# Altium schematic sheet ActuatorMKII_Microcontroller.SchDoc: ActuatorMKII_Microcontroller
size B; Date: MM/DD/YYYY; Author: Dylan Trainor; Organization: ORGANIZATION; Address1: ADDRESS 1; Address2: ADDRESS 2; Address3: ADDRESS 3; Address4: ADDRESS 4; Revision: -; SheetNumber: 4; SheetTotal: 6; ENG_APP_DATE: --/--/--; DSN_APP_DATE: --/--/--; CHK_APP_DATE: --/--/--
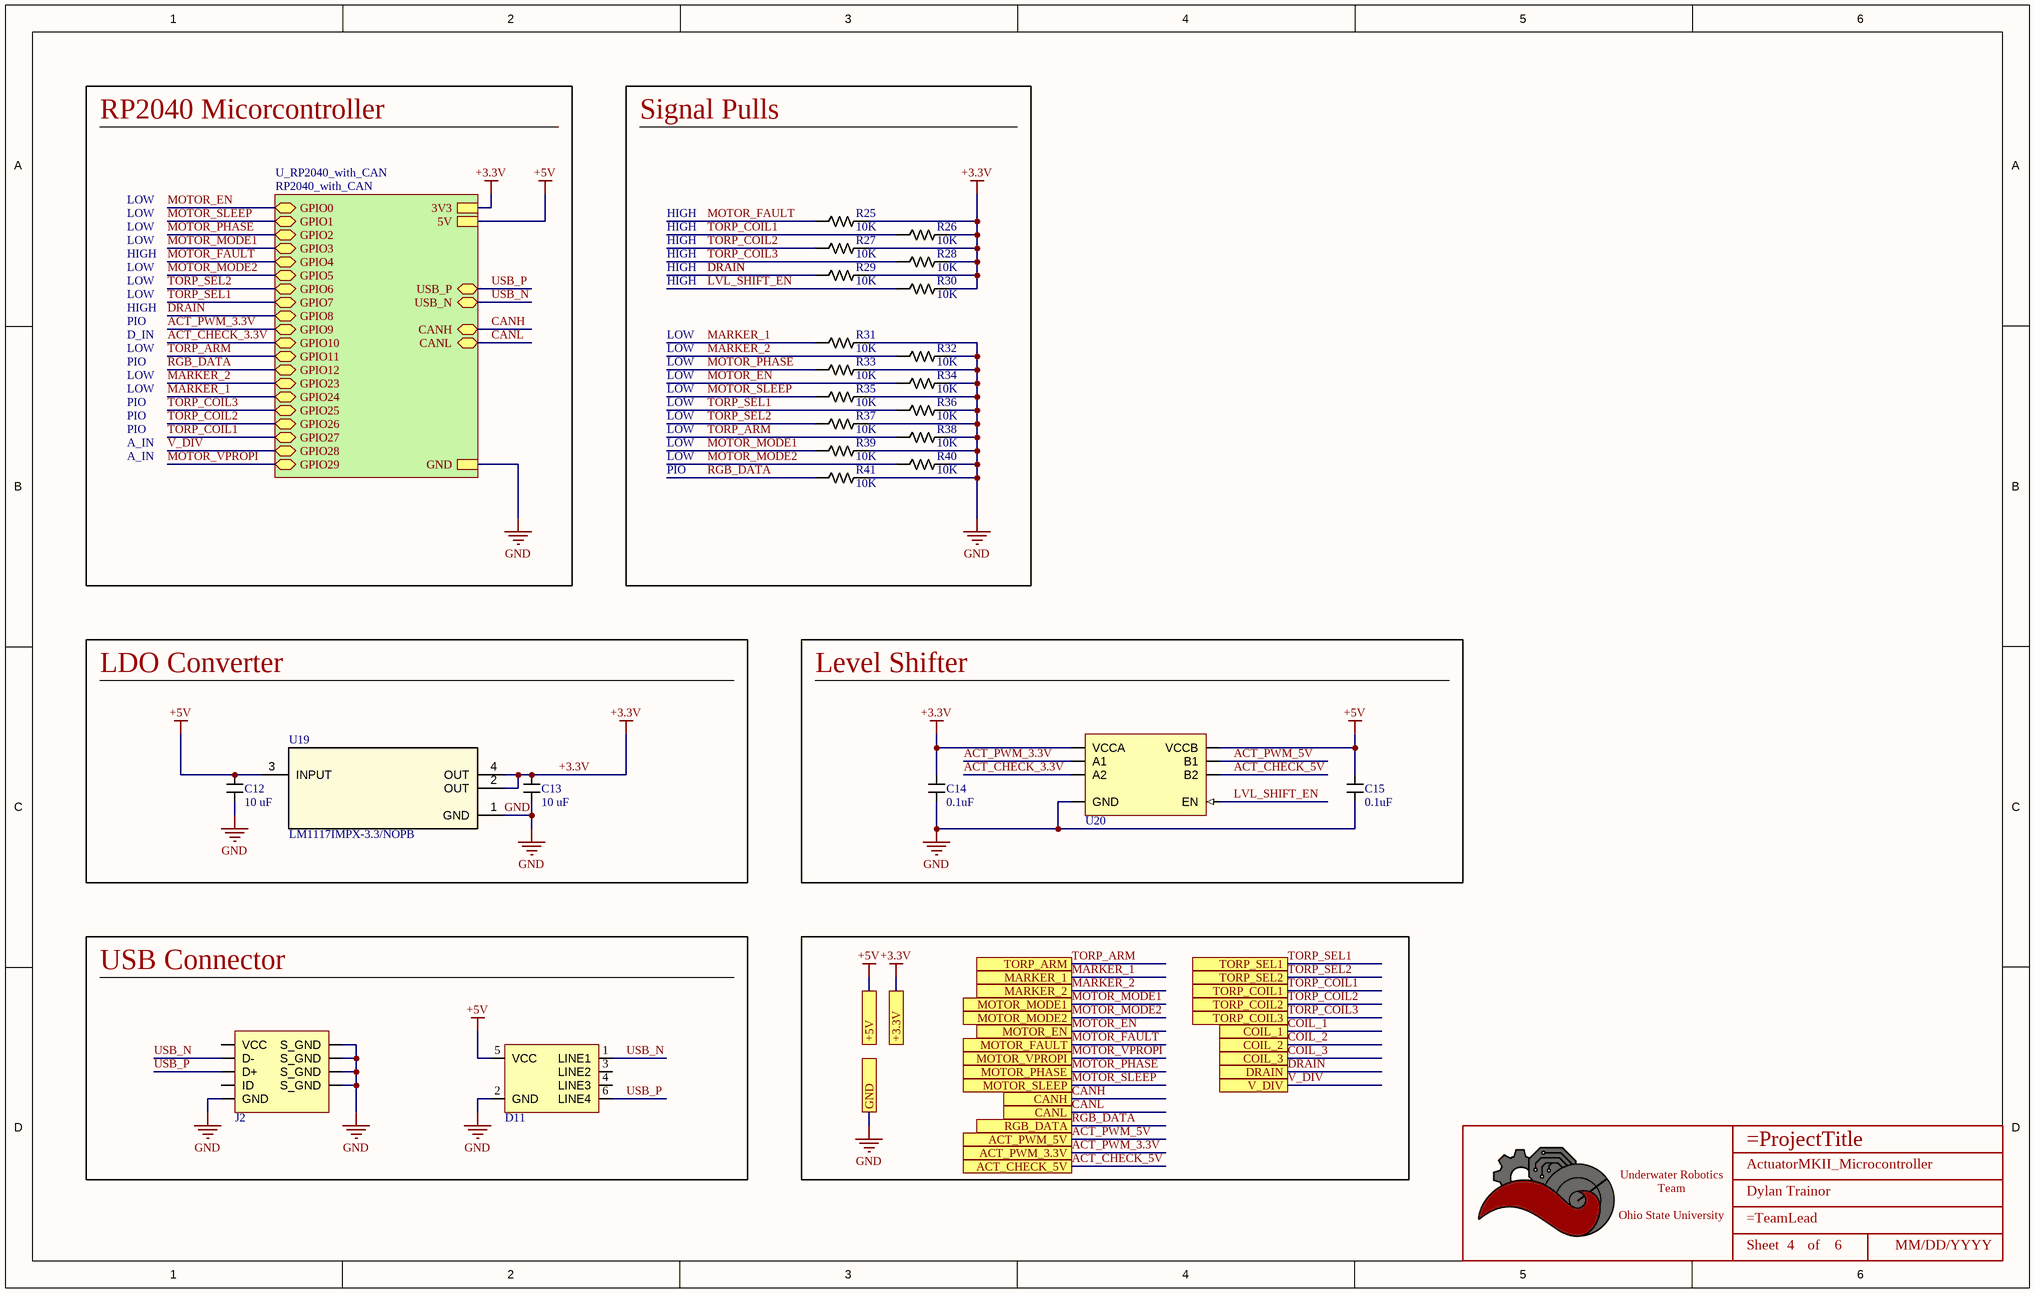
[diagram p0: ActuatorMKII_Microcontroller.SchDoc]

## Parts
*  Title_Block  [LOGO]  (value not drawn)  (graphical)
C12  Value (uF): 10 uF  [CAPACITOR_0603]  (hidden comment: 10uF Ceramic 6.3V)
C13  Value (uF): 10 uF  [CAPACITOR_0603]  (hidden comment: 10uF Ceramic 6.3V)
C14  value 0.1uF  [CAPACITOR_0603]  (hidden comment: 100nF Ceramic 6.3V)
C15  value 0.1uF  [CAPACITOR_0603]  (hidden comment: 100nF Ceramic 6.3V)
D11  TVS DIODE 5VWM 25VC SOT23-6  [SOT 23-6L]  (value not drawn)
J2  USB_MICRO R/A  [CONN_MINIUSB]  (value not drawn)
R25  Value  (Ohms): 10K  [RESISTOR_0603]  (hidden comment: 10k Ohm 5% 1/10W)
R26  Value  (Ohms): 10K  [RESISTOR_0603]  (hidden comment: 10k Ohm 5% 1/10W)
R27  Value  (Ohms): 10K  [RESISTOR_0603]  (hidden comment: 10k Ohm 5% 1/10W)
R28  Value  (Ohms): 10K  [RESISTOR_0603]  (hidden comment: 10k Ohm 5% 1/10W)
R29  Value  (Ohms): 10K  [RESISTOR_0603]  (hidden comment: 10k Ohm 5% 1/10W)
R30  Value  (Ohms): 10K  [RESISTOR_0603]  (hidden comment: 10k Ohm 5% 1/10W)
R31  Value  (Ohms): 10K  [RESISTOR_0603]  (hidden comment: 10k Ohm 5% 1/10W)
R32  Value  (Ohms): 10K  [RESISTOR_0603]  (hidden comment: 10k Ohm 5% 1/10W)
R33  Value  (Ohms): 10K  [RESISTOR_0603]  (hidden comment: 10k Ohm 5% 1/10W)
R34  Value  (Ohms): 10K  [RESISTOR_0603]  (hidden comment: 10k Ohm 5% 1/10W)
R35  Value  (Ohms): 10K  [RESISTOR_0603]  (hidden comment: 10k Ohm 5% 1/10W)
R36  Value  (Ohms): 10K  [RESISTOR_0603]  (hidden comment: 10k Ohm 5% 1/10W)
R37  Value  (Ohms): 10K  [RESISTOR_0603]  (hidden comment: 10k Ohm 5% 1/10W)
R38  Value  (Ohms): 10K  [RESISTOR_0603]  (hidden comment: 10k Ohm 5% 1/10W)
R39  Value  (Ohms): 10K  [RESISTOR_0603]  (hidden comment: 10k Ohm 5% 1/10W)
R40  Value  (Ohms): 10K  [RESISTOR_0603]  (hidden comment: 10k Ohm 5% 1/10W)
R41  Value  (Ohms): 10K  [RESISTOR_0603]  (hidden comment: 10k Ohm 5% 1/10W)
U19  LM1117IMPX-3.3/NOPB  [SOT-223-4]
U20  IC TRANSLTR BIDIRECTIONAL 8MSOP  [MSOP-8_PI4ULS5V202UEX]  (value not drawn)

## Blocks framed on the sheet
Signal Pulls: R25-R41
LDO Converter: C12 C13 U19
Level Shifter: C14 C15 U20
USB Connector: D11 J2

## Sub-sheets
U_RP2040_with_CAN = RP2040_with_CAN: USB_P (bidir), USB_N (bidir), 5V, CANH (bidir), CANL (bidir), GPIO0 (bidir), GPIO1 (bidir), GPIO2 (bidir), GPIO3 (bidir), GPIO4 (bidir), GPIO5 (bidir), GPIO6 (bidir), GPIO7 (bidir), GPIO8 (bidir), GPIO9 (bidir), GPIO10 (bidir), GPIO11 (bidir), GPIO12 (bidir), GPIO23 (bidir), GPIO24 (bidir), GPIO25 (bidir), GPIO26 (bidir), GPIO27 (bidir), GPIO28 (bidir), GPIO29 (bidir), 3V3, GND

## Ports
+3.3V, +5V, ACT_CHECK_5V, ACT_PWM_3.3V, ACT_PWM_5V, CANH, CANL, COIL_1, COIL_2, COIL_3, DRAIN, GND, MARKER_1, MARKER_2, MOTOR_EN, MOTOR_FAULT, MOTOR_MODE1, MOTOR_MODE2, MOTOR_PHASE, MOTOR_SLEEP, MOTOR_VPROPI, RGB_DATA, TORP_ARM, TORP_COIL1, TORP_COIL2, TORP_COIL3, TORP_SEL1, TORP_SEL2, V_DIV

## Nets
+3.3V: C13.1 C14.1 R25.1 R26.1 R27.1 R28.1 R29.1 R30.1 U19.2(OUT) U19.4(OUT) U20.1(VCCA) ; port +3.3V, sheet U_RP2040_with_CAN/3V3
+5V: C12.1 C15.1 D11.5(VCC) U19.3(INPUT) U20.8(VCCB) ; port +5V, sheet U_RP2040_with_CAN/5V
GND: C12.2 C13.2 C14.2 C15.2 D11.2(GND) J2.5(GND) J2.6(S_GND) J2.7(S_GND) J2.8(S_GND) J2.9(S_GND) R31.1 R32.1 R33.1 R34.1 R35.1 R36.1 R37.1 R38.1 R39.1 R40.1 R41.1 U19.1(GND) U20.4(GND) ; port GND, sheet U_RP2040_with_CAN/GND
ACT_CHECK_3.3V: U20.3(A2) ; sheet U_RP2040_with_CAN/GPIO10
ACT_CHECK_5V: U20.6(B2) ; port ACT_CHECK_5V
ACT_PWM_3.3V: U20.2(A1) ; port ACT_PWM_3.3V, sheet U_RP2040_with_CAN/GPIO9
ACT_PWM_5V: U20.7(B1) ; port ACT_PWM_5V
CANH: port CANH, sheet U_RP2040_with_CAN/CANH
CANL: port CANL, sheet U_RP2040_with_CAN/CANL
COIL_1: port COIL_1
COIL_2: port COIL_2
COIL_3: port COIL_3
DRAIN: R29.2 ; port DRAIN, sheet U_RP2040_with_CAN/GPIO8
LVL_SHIFT_EN: R30.2 U20.5(EN)
MARKER_1: R31.2 ; port MARKER_1, sheet U_RP2040_with_CAN/GPIO24
MARKER_2: R32.2 ; port MARKER_2, sheet U_RP2040_with_CAN/GPIO23
MOTOR_EN: R34.2 ; port MOTOR_EN, sheet U_RP2040_with_CAN/GPIO0
MOTOR_FAULT: R25.2 ; port MOTOR_FAULT, sheet U_RP2040_with_CAN/GPIO4
MOTOR_MODE1: R39.2 ; port MOTOR_MODE1, sheet U_RP2040_with_CAN/GPIO3
MOTOR_MODE2: R40.2 ; port MOTOR_MODE2, sheet U_RP2040_with_CAN/GPIO5
MOTOR_PHASE: R33.2 ; port MOTOR_PHASE, sheet U_RP2040_with_CAN/GPIO2
MOTOR_SLEEP: R35.2 ; port MOTOR_SLEEP, sheet U_RP2040_with_CAN/GPIO1
MOTOR_VPROPI: port MOTOR_VPROPI, sheet U_RP2040_with_CAN/GPIO29
RGB_DATA: R41.2 ; port RGB_DATA, sheet U_RP2040_with_CAN/GPIO12
TORP_ARM: R38.2 ; port TORP_ARM, sheet U_RP2040_with_CAN/GPIO11
TORP_COIL1: R26.2 ; port TORP_COIL1, sheet U_RP2040_with_CAN/GPIO27
TORP_COIL2: R27.2 ; port TORP_COIL2, sheet U_RP2040_with_CAN/GPIO26
TORP_COIL3: R28.2 ; port TORP_COIL3, sheet U_RP2040_with_CAN/GPIO25
TORP_SEL1: R36.2 ; port TORP_SEL1, sheet U_RP2040_with_CAN/GPIO7
TORP_SEL2: R37.2 ; port TORP_SEL2, sheet U_RP2040_with_CAN/GPIO6
USB_N: D11.1(LINE1) J2.2(D-) ; sheet U_RP2040_with_CAN/USB_N
USB_P: D11.6(LINE4) J2.3(D+) ; sheet U_RP2040_with_CAN/USB_P
V_DIV: port V_DIV, sheet U_RP2040_with_CAN/GPIO28

Not connected (* = marked no-connect by the designer): D11 3(LINE2) 4(LINE3); J2 1(VCC) 4(ID)

## Notes on the sheet
- RP2040 Micorcontroller
- LOW
- HIGH
- D_IN
- PIO
- A_IN
- DWG. NO.
- REV.
- SHT.
- THIS DOCUMENT AND THE DATA DISCLOSED HEREIN OR HEREWITH IS THE PROPERTY OF ALTIUM LIMITED AND MAY BE FREELY DISTRIBUTED IN WHOLE. NO RIGHTS ARE RESERVED OR EXPRESS OR IMPLIED WARANTEE GIVEN.
- REVISION
- DESCRIPTION
- DATE
- APPROVED
- ENG:
- APPROVALS
- PROJECT
- DSN:
- CHK:
- REFERENCE DOCUMENTS
- PROJECT REVISION:
- TITLE
- DOCUMENT REVISION:
- DESIGN ITEM:
- BOM:
- FAB DWG:
- PCB DWG:
- ASSY DWG:
- SCALE:
- SIZE
- B
- CAGE CODE
- FILE NAME
- DWG NO.
- SHEET
- OF
- REV
- (in symbol Title_Block) Underwater Robotics Team / Ohio State University; Sheet; of

## Library data of the parts
* = Title_Block: UWRT Schematic Title Block Template / Created June 2021, Dylan Trainor
C12 C13 = CAPACITOR_10uF_0603: Cap 10uF 6.3V +/-20% / Ceramic 0603; Made By: Flip B; ComponentLink1Description: Digikey; ComponentLink1URL: https://www.digikey.com/en/products/detail/samsung-electro-mechanics/CL10A106MQ8NNNC/3886777; Supplier 1: Digi-Key; Supplier Part Number 1: 1276-1119-1-ND; Tolerance: +/- 20%; Voltage: 6.3V
C14 C15 = CAPACITOR_0.1uF_0603: Cap 100nF 6.3V +/-10% / Ceramic 0603; Made By: Flip B; ComponentLink1Description: Datsheet; ComponentLink1URL: https://www.mouser.com/datasheet/2/212/KEM_C1002_X7R_SMD-1102033.pdf; Tolerance: +/- 10%; Voltage: 6.3V; Supplier 1: Digi-Key; Supplier Part Number 1: 399-15351-1-ND
D11 = RCLAMP0504S.TCT: 25V Clamp 6A (8/20µs) Ipp Tvs Diode Surface Mount SOT-23-6; Made By: Robert Pafford; Reverse Standoff Voltage (Typ): 5V; Breakdown Voltage (Min): 6V; Supplier 1: Digi-Key; Supplier Part Number 1: RCLAMP0504SCT-ND; Clamping Voltage (Max): 25V
J2 = CONN_MICROUSB: Amphenol Micro USB-B / USB2.0 5 Pin Right Angle SMD; Pitch: 0.65mm; Current Per Pin: 1.8A; Number of Positions: 5; Manufacturer: Amphenol; Configuration: Right Angle; Color: Silver; Created By: Flip B; ComponentLink1Description: Datasheet; ComponentLink1URL: https://cdn.amphenol-icc.com/media/wysiwyg/files/documentation/datasheet/inputoutput/io_usb_micro.pdf?__cf_chl_jschl_tk__=05693735e19256298f6ef6ca2bb2e65c376a4f56-1625503833-0-Abitsb0-ufjOXJYs_S3J3r2iTn-nObalbmXUksF1VvO_h_WEmRdMlUD1I8-hmWSEVWzY1pirKnrPZWfgY3851qyBZe5ZvnNQePLGIzUgdEIQBVUyW36RsbYpDLEWxJ4horD-5gChFgobLYqwmG5aHl0E8lIn_twwPPrOxilK2gP0q9t_CNOs_u5fMqXvXUrlsOv8tIE2NRlu6NVP8qtkL2GjhlkeTUbDMF8WvvpPDTFOgvZ4Y16Ej8F8AhWos88mo5B1HssXozw0XrkJQIqERITUu6rqloz9kf4ZzhBHtDAt-IkiAFY_Ds9SW8FYKKTtINJVpHZQ6Gyu1FFM4Dc9MO0maE8_mmNcwlxqyRoRk_MPWW8VyByXWM5RSp52jteRKw7FeI9WIYvCbPAOy0Eyib-aseIQsnGbglBcUY6_2xp8GYaJM38H3dNvBPsSOfJBPndKedwKHllxjkucXn6xsN0sDXkpGN-cu8_2bDTJ0g-uUucKSCooYX-ApSDNGpkA_p9zv1SOAD8c0zaZVmtiBsN75QpVz2rzq9_BFxOywPvR; Series: 10118192; Supplier 1: Digi-Key; Supplier Part Number 1: 609-4613-1-ND
R25-R41 = RESISTOR_10K_0603: RES 10k OHM 5% 1/10W 0603; Tolerance: +/- 5%; Wattage: 1/8W; Made By: Robert Pafford; ComponentLink1Description: Datasheet; ComponentLink1URL: https://www.bourns.com/docs/product-datasheets/CRxxxxx.pdf; Supplier: Digikey; Digikey Part Numer: CR0603-JW-104ELFTR-ND; Supplier 1: Digi-Key; Supplier Part Number 1: 2019-RK73B1JTTD103JCT-ND
U19 = LM1117IMPX-3.3/NOPB: IC REG LIN 3.3V 800MA SOT223-4; PartNumber: LM1117IMP-3.3/NOPB; Manufacturer: Texas Instruments; Vin (Max): 15V; Supplier 1: Digi-Key; Supplier Part Number 1: LM1117IMPX-3.3/NOPBCT-ND; Vout (Min/Fixed): 3.3V; Amp Out: 800mA; Package: SOT-223-4; Created By: Dylan T
U20 = PI4ULS5V202UEX: Voltage Level Translator Bidirectional 1 Circuit 2 Channel 20Mbps 8-MSOP; Made By: Robert Pafford; Channels: 2; Voltage Range: 1.2 V ~ 5.5 V; Channel Type: Bidirectional; Max Rate: 20 Mbps; Supplier 1: Digi-Key; Supplier Part Number 1: PI4ULS5V202UEXDICT-ND